# EAGLE design MC34063_Boost (EAGLE 6.5.0)
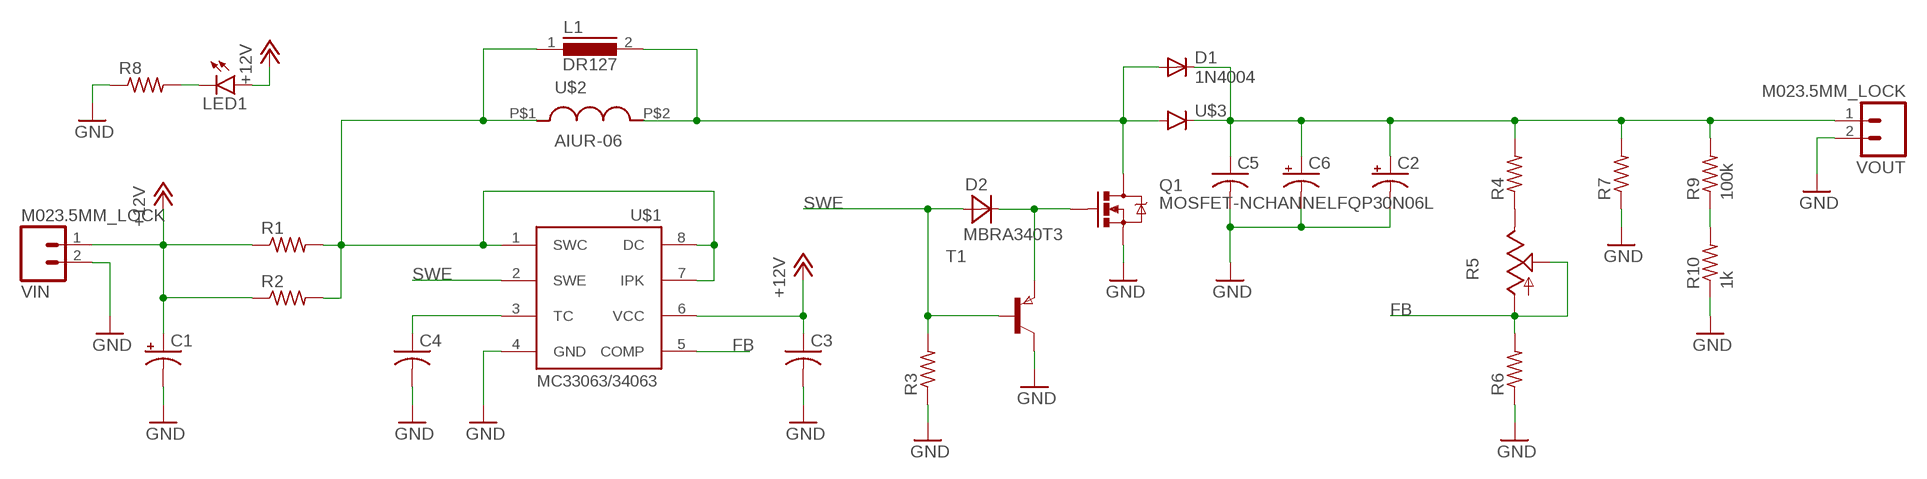
[diagram p0: schematic, sheet 1]

## Parts
C1  CPOL-USE3.5-8  [E3,5-8]
C2  CPOL-USE2.5-6  [E2,5-6]
C3  C-USC0805K  [C0805K]
C4  C-USC0805  [C0805]
C5  C-USC1206  [C1206]
C6  CPOL-USE3.5-8  [E3,5-8]
D1  1N4004  [DO41-10]
D2  MBRA340T3  [SMA]
L1  DR127  [DR127]
LED1  LED1206  [LED-1206]
Q1  MOSFET-NCHANNELFQP30N06L  [TO220V]
R1  R-US_R1206  [R1206]
R2  R-US_R1206  [R1206]
R3  R-US_R0805  [R0805]
R4  R-US_R0805  [R0805]
R5  TRIM_US-S64W  [S64W]
R6  R-US_R0805  [R0805]
R7  R-US_R0805  [R0805]
R8  R-US_R0805  [R0805]
R9  100k  R-US_R0805  [R0805]
R10  1k  R-US_R0805  [R0805]
T1  PNPSOT223  [SOT223]
U$1  MC33063/MC34063D  [SO08]
U$2  AIUR-06  [7MM_LEADS_12MM]
U$3  DIODESMA  [SMA-DIODE]
VIN  M023.5MM_LOCK  [SCREWTERMINAL-3.5MM-2_LOCK]
VOUT  M023.5MM_LOCK  [SCREWTERMINAL-3.5MM-2_LOCK]

## Nets
+12V: C1.+ C3.1 LED1.A R1.1 R2.1 U$1.6(VCC) VIN.1
FB: R5.A R5.S R6.2 U$1.5(COMP)
GND: C1.- C2.- C3.2 C4.2 C5.2 C6.- Q1.3(S) R3.1 R6.1 R7.1 R8.1 R10.1 T1.2(C) T1.4(C) U$1.4(GND) VIN.2 VOUT.2
HIGHV: C2.+ C5.1 C6.+ D1.C R4.2 R7.2 R9.2 U$3.C VOUT.1
N$1: C4.1 U$1.3(TC)
N$2: L1.1 R1.2 R2.2 U$1.1(SWC) U$1.7(IPK) U$1.8(DC) U$2.P$1
N$3: D1.A L1.2 Q1.2(D) U$2.P$2 U$3.A
N$4: LED1.C R8.2
N$5: R4.1 R5.E
N$6: D2.C Q1.1(G) T1.3(E)
SWE: D2.A R3.2 T1.1(B) U$1.2(SWE)
TEST: R9.1 R10.2

## Library data of the parts
C1 C2 C6 = rcl:CPOL-US: POLARIZED CAPACITOR, American symbol
C3-C5 = rcl:C-US: CAPACITOR, American symbol
D1 = diode:1N4004: DIODE general purpose rectifier, 1 A
D2 = diode:MBRA340T3: Surface Mount Schottky Power Rectifier Source: http://www.onsemi.com/pub_link/Collateral/MBRA340T3-D.PDF
L1 = inductors:DR127: High Power Density, High Efficiency, Shielded Inductors Source: coiltronics_dr_series.pdf
LED1 = SparkFun-LED:LED: LEDs Standard schematic elements and footprints for 5mm, 3mm, 1206, and 0603 sized LEDs. 5mm - Spark Fun Electronics SKU : COM-00529 (and others)
Q1 = SparkFun-DiscreteSemi:MOSFET-NCHANNEL: Common NMOSFET Parts MFG P/N Store ID Prod ID FDD8780 TRANS-09984 SI7820DN TRANS-11055 FDS6630A IC-08089 2N7002PW TRANS-11151 FQP30N06L COM-10213 TRANS-10060 BSS123LT1G TRANS-08345 BSS138 TRANS-00830 BS170 2N7000; PROD_ID: TRANS-10060
R1-R4 R6-R10 = rcl:R-US_: RESISTOR, American symbol
R5 = pot:TRIM_US-: POTENTIOMETER
T1 = zetex:PNPSOT223: PNP TRANSISTOR; MPN: DJT4030P-13; OC_FARNELL: 1710675; OC_NEWARK: 25R4489
U$1 = adafruit:MC33063/MC34063: MC33063 and MC34063 Basic DC/DC converter with internal power-NPN transistor, 100KHz, 1.5A peak switch current. 3-40 input/output.
U$2 = inductors:AIUR-06
U$3 = SparkFun-DiscreteSemi:DIODE: Diode These are standard reverse protection diodes and small signal diodes. SMA package can handle up to about 1A. SOD-323 can handle about 200mA. What the SOD-323 package when ordering, there are some mfgs out there that are 5-pin packages.
VIN VOUT = SparkFun-Connectors:M02: Standard 2-pin 0.1" header. Use with - straight break away headers ( PRT-00116) - right angle break away headers (PRT-00553) - swiss pins (PRT-00743) - machine pins (PRT-00117) - female headers (PRT-00115) Molex polarized connector foot print use with: PRT-08233 with associated crimp pins and housings. 2.54_SCREWTERM for use with PRT-10571. 3.5mm Screw Terminal footprints for PRT-08084 5mm Screw Terminal footprints for use with PRT-08432

## Board
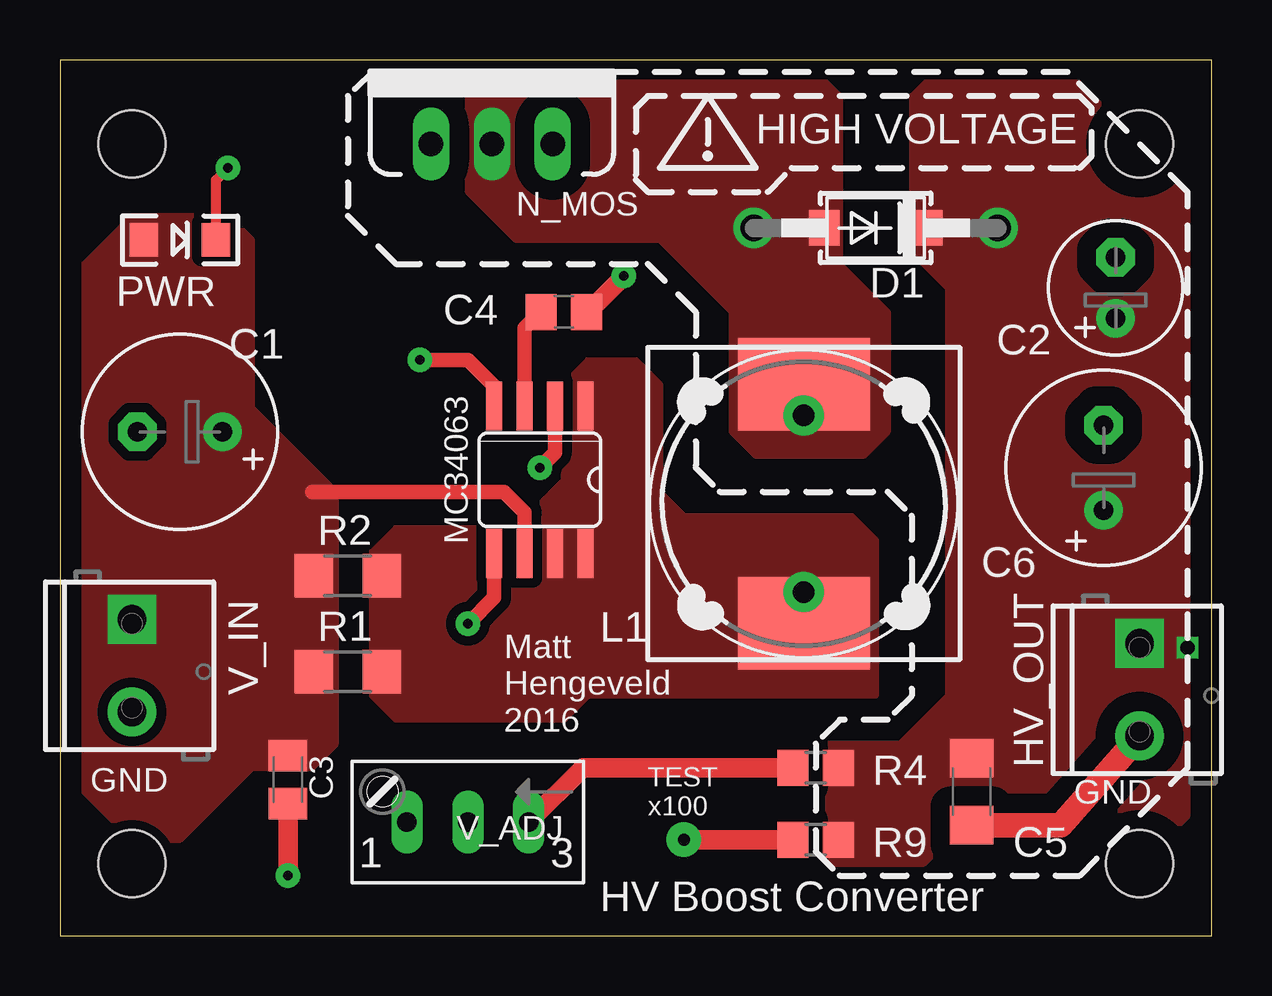
[diagram p1: board, top side]
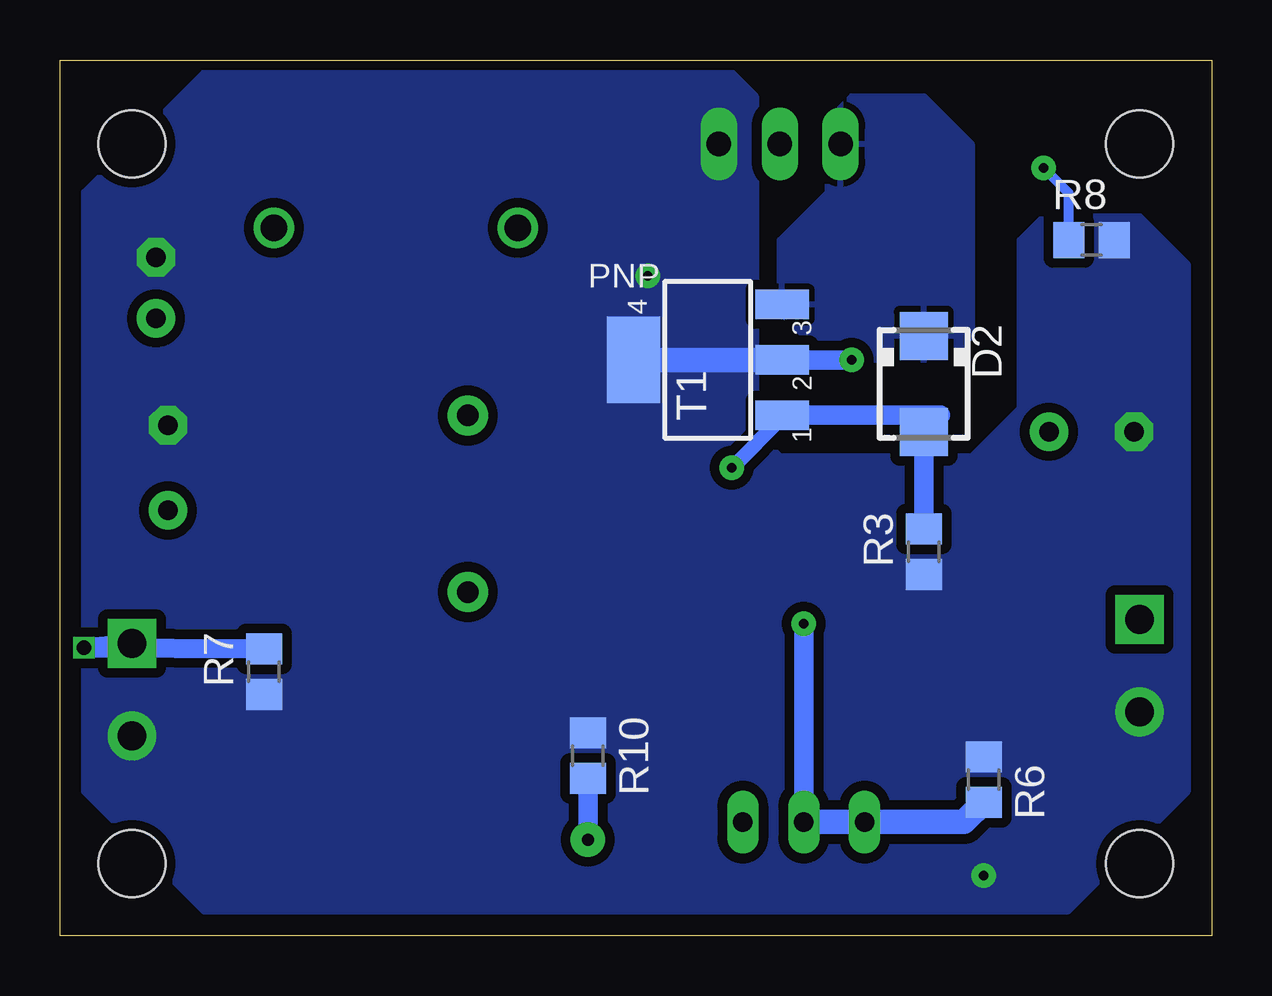
[diagram p2: board, bottom side, seen from below]

Size 48 x 36.5 mm. Coordinates in mm from the lower left corner, seen from the top.
Outline: 0,0 48,0 48,36.5 0,36.5 0,0
Copper layers (1*16): Top 0.035mm / dielectric 1.5mm / Bottom 0.035mm
Design rules "SeeedStudio_2layer_DRU_no_angle_20140221": minimum track width 6mil, minimum drill 12mil, track to track 6mil, track to pad 6mil, pad to pad 6mil, via to via 6mil, smd to smd 0mil, copper to edge 10mil, drill to drill 10mil, minimum pad ring 10mil, minimum via ring 6mil, stop-mask expansion 2mil, vias tented up to drill 100mil, thermal gap 10mil
Holes 2.8 mm at 3,33 3,3 45,33 45,3

### Footprints (pad centres in the part's own frame; a part is rotated, then mirrored left to right if it is on the bottom)
E3,5-8 = drill 0.813 pad 1.6: + -1.778,0 | drill 0.813 pad 1.6 octagon: - 1.778,0
E2,5-6 = drill 0.813 pad 1.6: + -1.27,0 | drill 0.813 pad 1.6 octagon: - 1.27,0
C0805K = smd 1.3 x 1.6: 1 -1,0; 2 1,0
C0805 = smd 1.3 x 1.5: 1 -0.95,0; 2 0.95,0
C1206 = smd 1.6 x 1.8: 1 -1.4,0; 2 1.4,0
DO41-10 = drill 1.118: A 5.08,0; C -5.08,0
SMA = smd 2 x 2: A 2,0; C -2,0
DR127 = smd 3.85 x 5.5: 1 -4.975,0; 2 4.975,0
LED-1206 = smd 1.2 x 1.4: A -1.5,0; C 1.5,0
TO220V = drill 1.016 long: 1 -2.54,0; 2 0,0; 3 2.54,0
R1206 = smd 1.6 x 1.803: 1 -1.422,0; 2 1.422,0
R0805 = smd 1.3 x 1.5: 1 -0.95,0; 2 0.95,0
S64W = drill 0.813 long: A 2.54,1.27; E -2.54,1.27; S 0,1.27
SOT223 = smd 1.219 x 2.235: 1 -2.311,-3.099; 2 0,-3.099; 3 2.311,-3.099 | smd 3.6 x 2.2: 4 0,3.099
SO08 = smd 0.66 x 2.032: 1 -1.905,-3.073; 2 -0.635,-3.073; 3 0.635,-3.073; 4 1.905,-3.073; 5 1.905,3.073; 6 0.635,3.073; 7 -0.635,3.073; 8 -1.905,3.073
7MM_LEADS_12MM = drill 0.9 pad 1.676: P$1 -3.68,0; P$2 3.68,0
SMA-DIODE = smd 1.27 x 1.47: A -2.15,0; C 2.15,0
SCREWTERMINAL-3.5MM-2_LOCK = drill 1.2 pad 2.032 square: 1 -0.178,0 | drill 1.2 pad 2.032: 2 3.678,0

### Placement (x,y rotation side)
C1  5,21 180 top
C2  44,27 90 top
C3  9.5,6.5 270 top
C4  21,26 0 top
C5  38,6 270 top
C6  43.5,19.5 90 top
D1  34,29.5 180 top
D2  12,23 270 bottom
L1  31,18 90 top
LED1  5,29 0 top
Q1  18,33 0 top
R1  12,11 0 top
R2  12,15 0 top
R3  12,16 90 bottom
R4  31.5,7 0 top
R5  17,6 180 top
R6  9.5,6.5 270 bottom
R7  39.5,11 90 bottom
R8  5,29 180 bottom
R9  31.5,4 0 top
R10  26,7.5 270 bottom
T1  21,24 90 bottom
U$1  20,19 180 top
U$2  31,18 90 top
U$3  34,29.5 0 top
VIN  3,13 270 top
VOUT  45,12 270 top

### Tracks (layer width: path | path; a pad name or v marks a point on that pad's centre or on a via)
+12V
  Top 0.61: U$1.6 19.36,17.64 18.5,18.5 10.5,18.5
  pour Top (isolate 0.406, no thermals): 8,22 8,29 7,30 3,30 1,28 1,6 3,4 5,4 8,7 10.5,7 11.5,8 11.5,18.5
FB  (via drill 0.4 pad 1.02)
  Top 0.61: U$1.5 18.09,14.1 v17,13
  Bottom 0.813: v17,13 R5.S
  Bottom 1.016: R5.S R5.A 10.32,4.73 R6.2
GND  (via drill 0.4 pad 1.02)
  Top 0.61: U$1.4 18.09,22.91 17,24 v15,24
  Top 0.813: C3.2 v9.5,2.5 | C4.2 22,26 v23.5,27.5
  Top 1.016: C5.2 41.72,4.6 VOUT.2
  Bottom 0.813: T1.2 v15,24
  Bottom 1.016: T1.2 T1.4
  pour Bottom (isolate 0.406, no thermals): 42,36 20,36 19,35 19,21 18,20 10,20 8,22 8,29 7,30 3,30 1,28 1,6 6,1 42,1 47,6 47,31
HIGHV  (via drill 0.6)
  Bottom 0.813: R7.2 v47,12 VOUT.1
  pour Top (isolate 0.813, no thermals): 42,36 36.5,36 35.5,35 35.5,28.5 37,27 37,10 35,8 32,8 32,3 36,3 37,4 46,4 47,5 47,31
N$1
  Top 0.61: U$1.3 19.36,25.32 C4.1
N$2
  pour Top (isolate 0.406, no thermals): 34,16.5 34,10 22,10 21,9 14,9 13,10 13,16 14,17 19,17 21,19 21,23 22,24 24,24 25,23 25,18.5 26,17.5 33,17.5
N$3
  pour Top (isolate 0.813, no thermals): 18,36 31.5,36 32.5,35 32.5,28 34.5,26 34.5,21 33.5,20 29,20 28,21 28,26 25,29 19,29 17,31 17,35
N$4  (via drill 0.4 pad 1.02)
  Top 0.406: LED1.C 6.5,31.5 v7,32
  Bottom 0.406: R8.2 5.95,30.95 v7,32
N$5
  Top 0.813: R4.1 21.81,7 R5.E
N$6
  pour Bottom (isolate 0.406, rank 2): 15,35 12,35 10,33 10,25 11,24 16,24 18,26 18,29 16,31 16,34
SWE  (via drill 0.4 pad 1.02)
  Top 0.61: 20.64,22.64 U$1.2 20.64,20.14 v20,19.5
  Bottom 0.61: T1.1 17.9,21.6 v20,19.5
  Bottom 0.813: T1.1 11.31,21.69 D2.A R3.2
TEST  (via drill 0.5 pad 1.42)
  Top 0.813: R9.1 v26,4
  Bottom 0.813: R10.2 v26,4

### Text on the board
tPlace: HIGH VOLTAGE | N_MOS | PWR | MC34063 | V_IN | L1 | Matt / Hengeveld / 2016 | GND | HV_OUT | GND | V_ADJ | TEST / x100 | HV Boost Converter
bPlace: PNP | D2